# EAGLE design JOYSTICK (EAGLE 6.3)
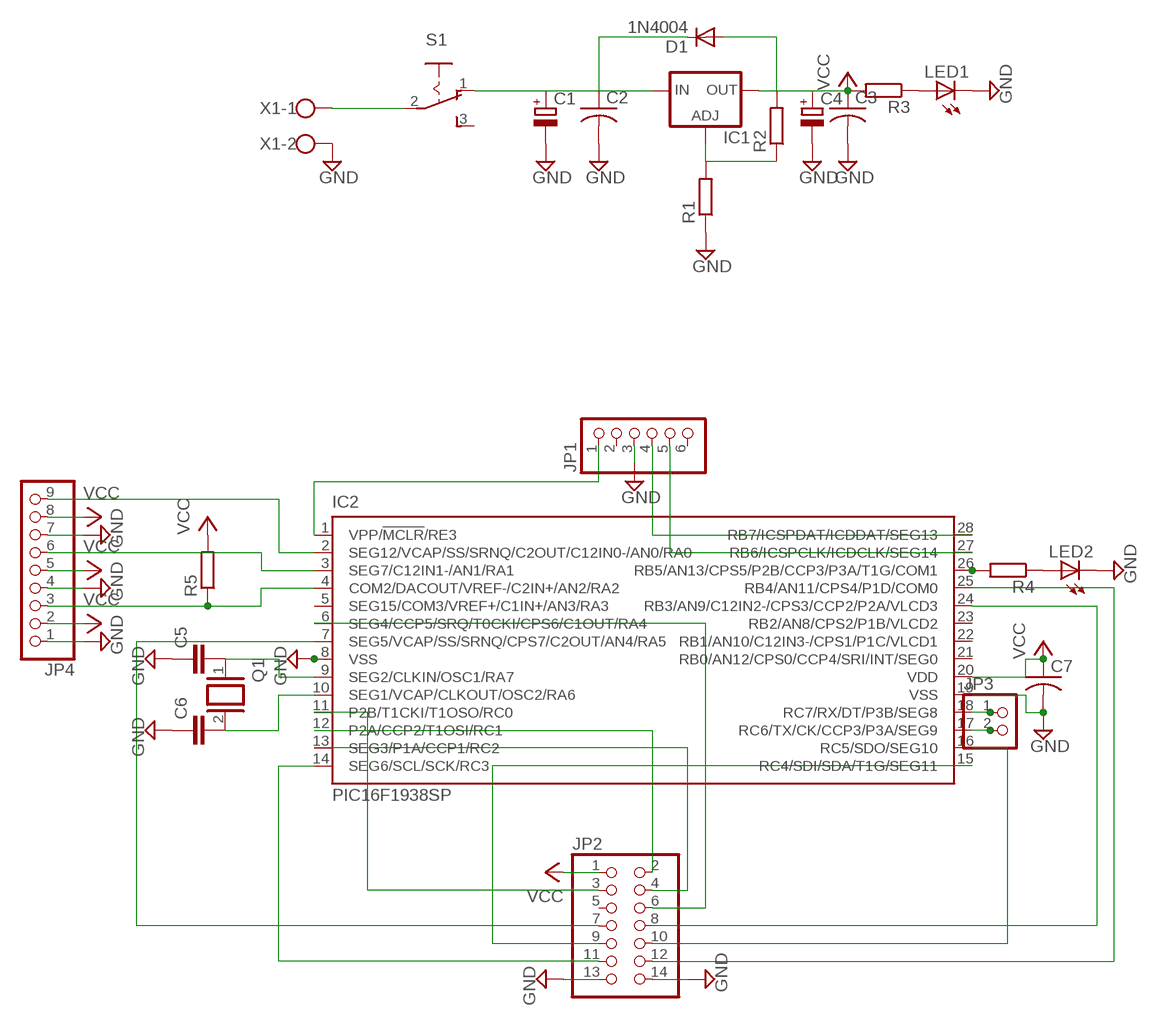
[diagram p0: schematic, sheet 1]

## Parts
C1  CPOL-EUE3.5-8  [E3,5-8]
C2  C-US050-030X075  [C050-030X075]
C3  C-US050-030X075  [C050-030X075]
C4  CPOL-EUE3.5-8  [E3,5-8]
C5  C-EU025-025X050  [C025-025X050]
C6  C-EU025-025X050  [C025-025X050]
C7  C-US050-030X075  [C050-030X075]
D1  1N4004  [DO41-10]
IC1  LM317TS  [317TS]
IC2  PIC16F1938SP  [DIL28-3]
JP1  PINHD-1X6  [1X06]
JP2  PINHD-2X7  [2X07]
JP3  PINHD-1X2  [1X02]
JP4  PINHD-1X9  [1X09]
LED1  LED5MM  [LED5MM]
LED2  LED5MM  [LED5MM]
Q1  XTAL/S  [QS]
R1  R-EU_0207/10  [0207/10]
R2  R-EU_0207/10  [0207/10]
R3  R-EU_0207/10  [0207/10]
R4  R-EU_0207/10  [0207/10]
R5  R-EU_0207/10  [0207/10]
S1  255SB  [255SB]
X1  W237-102  [W237-102]

## Nets
GND: C1.- C2.2 C3.2 C4.- C5.1 C6.1 C7.2 IC2.8(VSS) IC2.19(VSS) JP1.3 JP2.13 JP2.14 JP4.1 JP4.4 JP4.7 LED1.K(C) LED2.K(C) R1.1 X1.2
N$1: S1.2(P) X1.1
N$2: C1.+ C2.1 D1.C IC1.3(IN) S1.1(O)
N$3: IC2.11(P2B/T1CKI/T1OSO/RC0) JP2.3
N$4: LED1.A R3.1
N$5: IC1.1(ADJ) R1.2 R2.1
N$6: IC2.1(VPP/!MCLR!/RE3) JP1.1
N$7: IC2.2(SEG12/VCAP/SS/SRNQ/C2OUT/C12IN0-/AN0/RA0) JP4.9
N$8: IC2.3(SEG7/C12IN1-/AN1/RA1) JP4.6
N$9: IC2.4(COM2/DACOUT/VREF-/C2IN+/AN2/RA2) JP4.3 R5.1
N$10: IC2.12(P2A/CCP2/T1OSI/RC1) JP2.2
N$11: IC2.13(SEG3/P1A/CCP1/RC2) JP2.4
N$12: IC2.6(SEG4/CCP5/SRQ/T0CKI/CPS6/C1OUT/RA4) JP2.6
N$13: IC2.7(SEG5/VCAP/SS/SRNQ/CPS7/C2OUT/AN4/RA5) JP2.7
N$14: IC2.25(RB4/AN11/CPS4/P1D/COM0) JP2.12
N$15: IC2.24(RB3/AN9/C12IN2-/CPS3/CCP2/P2A/VLCD3) JP2.8
N$19: IC2.14(SEG6/SCL/SCK/RC3) JP2.11
N$20: IC2.15(RC4/SDI/SDA/T1G/SEG11) JP2.9
N$21: IC2.16(RC5/SDO/SEG10) JP2.10
N$22: IC2.17(RC6/TX/CK/CCP3/P3A/SEG9) JP3.2
N$23: IC2.18(RC7/RX/DT/P3B/SEG8) JP3.1
N$31: IC2.26(RB5/AN13/CPS5/P2B/CCP3/P3A/T1G/COM1) R4.2
N$32: IC2.27(RB6/ICSPCLK/ICDCLK/SEG14) JP1.5
N$33: IC2.28(RB7/ICSPDAT/ICDDAT/SEG13) JP1.4
N$36: C5.2 IC2.9(SEG2/CLKIN/OSC1/RA7) Q1.1
N$37: C6.2 IC2.10(SEG1/VCAP/CLKOUT/OSC2/RA6) Q1.2
N$40: LED2.A R4.1
VCC: C3.1 C4.+ C7.1 D1.A IC1.2(OUT) IC2.20(VDD) JP2.1 JP4.2 JP4.5 JP4.8 R2.2 R3.2 R5.2
Unconnected: IC2.5(SEG15/COM3/VREF+/C1IN+/AN3/RA3) IC2.21(RB0/AN12/CPS0/CCP4/SRI/INT/SEG0) IC2.22(RB1/AN10/C12IN3-/CPS1/P1C/VLCD1) IC2.23(RB2/AN8/CPS2/P1B/VLCD2) JP1.2 JP1.6 JP2.5 S1.3(S)

## Library data of the parts
C1 C4 = rcl:CPOL-EU: POLARIZED CAPACITOR, European symbol
C2 C3 C7 = rcl:C-US: CAPACITOR, American symbol
C5 C6 = rcl:C-EU: CAPACITOR, European symbol
D1 = diode:1N4004: DIODE general purpose rectifier, 1 A
IC1 = v-reg:LM317TS: VOLTAGE REGULATOR
IC2 = microchip:PIC16F19*: Flash-Based, 8-Bit CMOS Microcontrollers wtih LCD Driver and nanoWatt XLP Technology Auto generated by make-symbol-device-package-bsdl.ulp Rev. 33 Source: http://ww1.microchip.com/downloads/en/DeviceDoc/41364D.pdf; MPN: PIC16F1938-I/SP; OC_FARNELL: 1755829; OC_NEWARK: 08R1949
JP1 = pinhead:PINHD-1X6: PIN HEADER
JP2 = pinhead:PINHD-2X7: PIN HEADER
JP3 = pinhead:PINHD-1X2: PIN HEADER
JP4 = pinhead:PINHD-1X9: PIN HEADER
LED1 LED2 = led:LED: LED OSRAM: - CHIPLED LG R971, LG N971, LY N971, LG Q971, LY Q971, LO R971, LY R971 LH N974, LH R974 LS Q976, LO Q976, LY Q976 LO Q996 - Hyper CHIPLED LW Q18S LB Q993, LB Q99A, LB R99A - SideLED LS A670, LO A670, LY A670, LG A670, LP A670 LB A673, LV A673, LT A673, LW A673 LH A674 LY A675 LS A676, LA A676, LO A676, LY A676, LW A676 LS A679, LY A679, LG A679 - Hyper Micro SIDELED® LS Y876, LA Y876, LO Y876, LY Y876 LT Y87S - SmartLED LW L88C, LW L88S LB L89C, LB L89S, LG L890 LS L89K, LO L89K, LY L89K LS L896, LA L896, LO L896, LY L896 - TOPLED LS T670, LO T670, LY T670, LG T670, LP T670 LSG T670, LSP T670, LSY T670, LOP T670, LYG T670 LG T671, LOG T671, LSG T671 LB T673, LV T673, LT T673, LW T673 LH T674 LS T676, LA T676, LO T676, LY T676, LB T676, LH T676, LSB T676, LW T676 LB T67C, LV T67C, LT T67C, LS T67K, LO T67K, LY T67K, LW E67C LS E67B, LA E67B, LO E67B, LY E67B, LB E67C, LV E67C, LT E67C LW T67C LS T679, LY T679, LG T679 LS T770, LO T770, LY T770, LG T770, LP T770 LB T773, LV T773, LT T773, LW T773 LH T774 LS E675, LA E675, LY E675, LS T675 LS T776, LA T776, LO T776, LY T776, LB T776 LHGB T686 LT T68C, LB T68C - Hyper Mini TOPLED® LB M676 - Mini TOPLED Santana® LG M470 LS M47K, LO M47K, LY M47K Source: http://www.osram.convergy.de LUXEON: - LUMILED® LXK2-PW12-R00, LXK2-PW12-S00, LXK2-PW14-U00, LXK2-PW14-V00 LXK2-PM12-R00, LXK2-PM12-S00, LXK2-PM14-U00 LXK2-PE12-Q00, LXK2-PE12-R00, LXK2-PE12-S00, LXK2-PE14-T00, LXK2-PE14-U00 LXK2-PB12-K00, LXK2-PB12-L00, LXK2-PB12-M00, LXK2-PB14-N00, LXK2-PB14-P00, LXK2-PB14-Q00 LXK2-PR12-L00, LXK2-PR12-M00, LXK2-PR14-Q00, LXK2-PR14-R00 LXK2-PD12-Q00, LXK2-PD12-R00, LXK2-PD12-S00 LXK2-PH12-R00, LXK2-PH12-S00 LXK2-PL12-P00, LXK2-PL12-Q00, LXK2-PL12-R00 Source: www.luxeon.com KINGBRIGHT: KA-3528ASYC Source: www.kingbright.com
Q1 = special:XTAL/S: CRYSTAL
R1-R5 = resistor:R-EU_: RESISTOR, European symbol
S1 = switch:255SB: SLIDING SWITCH Distributor Buerklin, 11G810
X1 = con-wago-500:W237-102: WAGO SCREW CLAMP; MPN: 237-102; OC_FARNELL: unknown; OC_NEWARK: 70K9898

## Board
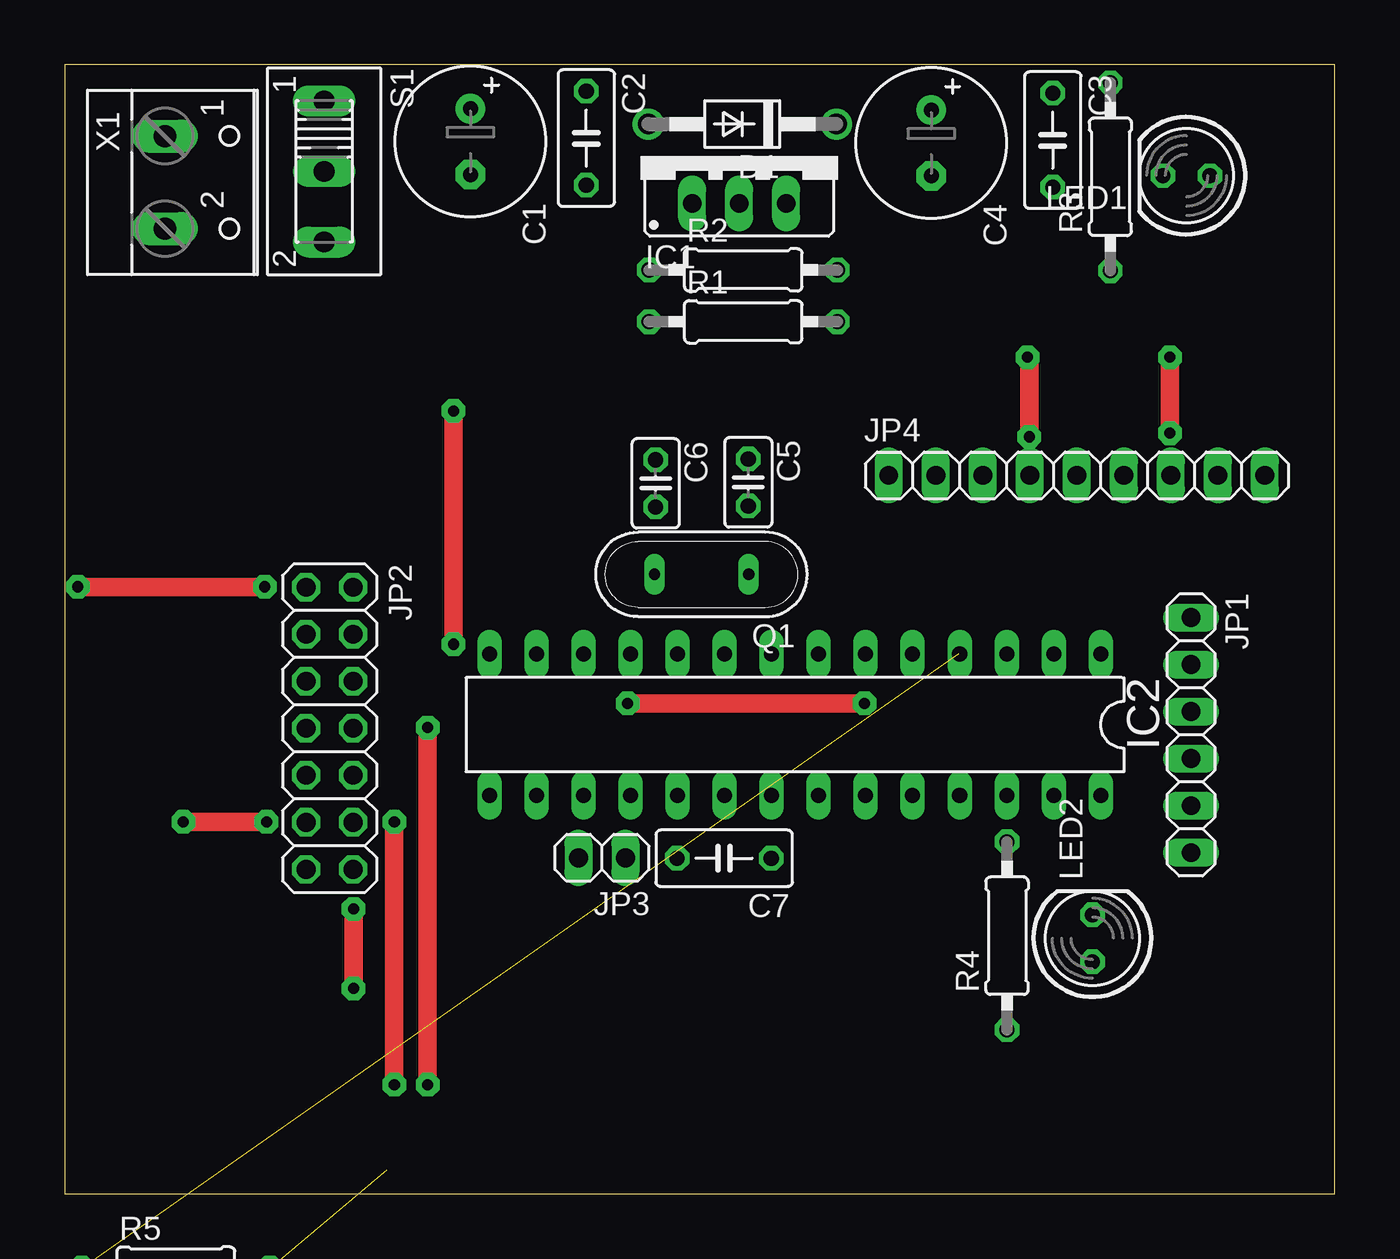
[diagram p1: board, top side]
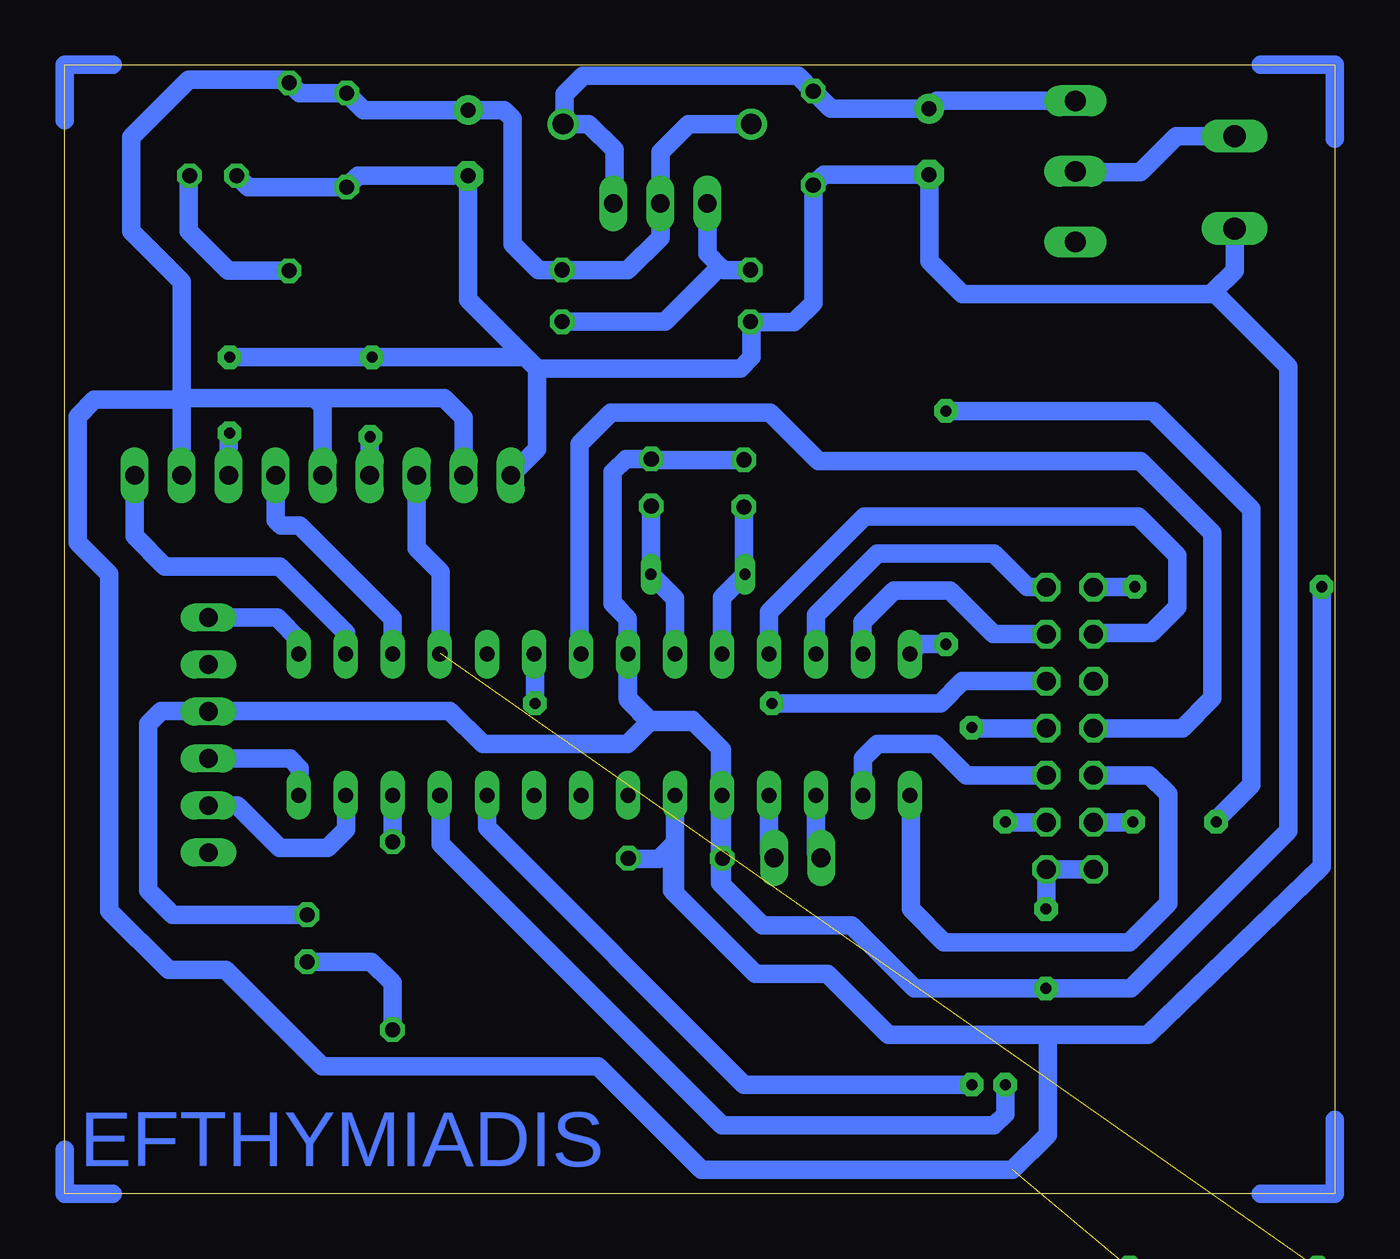
[diagram p2: board, bottom side, seen from below]

Size 68.6 x 61 mm. Coordinates in mm from the lower left corner, seen from the top.
Outline: 0,0 68.6,0 68.6,61 0,61 0,0
Copper layers (1*16): Top 0.035mm / dielectric 1.5mm / Bottom 0.035mm
Design rules "default": minimum track width 10mil, minimum drill 24mil, track to track 8mil, track to pad 8mil, pad to pad 8mil, via to via 8mil, smd to smd 8mil, copper to edge 40mil, drill to drill 8mil, minimum pad ring 10mil, minimum via ring 8mil, stop-mask expansion 4mil, vias tented up to drill 0mil, thermal gap 10mil

### Footprints (pad centres in the part's own frame; a part is rotated, then mirrored left to right if it is on the bottom)
E3,5-8 = drill 0.813 pad 1.6: + -1.778,0 | drill 0.813 pad 1.6 octagon: - 1.778,0
C050-030X075 = drill 0.813 octagon: 1 -2.54,0; 2 2.54,0
C025-025X050 = drill 0.813 octagon: 1 -1.27,0; 2 1.27,0
DO41-10 = drill 1.118: A 5.08,0; C -5.08,0
317TS = drill 1.016 long: 1 -2.54,-2.54; 2 0,-2.54; 3 2.54,-2.54
DIL28-3 = drill 0.813 long: 1 -16.51,-3.81; 2 -13.97,-3.81; 3 -11.43,-3.81; 4 -8.89,-3.81; 5 -6.35,-3.81; 6 -3.81,-3.81; 7 -1.27,-3.81; 8 1.27,-3.81; 9 3.81,-3.81; 10 6.35,-3.81; 11 8.89,-3.81; 12 11.43,-3.81; 13 13.97,-3.81; 14 16.51,-3.81; 15 16.51,3.81; 16 13.97,3.81; 17 11.43,3.81; 18 8.89,3.81; 19 6.35,3.81; 20 3.81,3.81; 21 1.27,3.81; 22 -1.27,3.81; 23 -3.81,3.81; 24 -6.35,3.81; 25 -8.89,3.81; 26 -11.43,3.81; 27 -13.97,3.81; 28 -16.51,3.81
1X06 = drill 1.016 long: 1 -6.35,0; 2 -3.81,0; 3 -1.27,0; 4 1.27,0; 5 3.81,0; 6 6.35,0
2X07 = drill 1.016 octagon: 1 -7.62,-1.27; 2 -7.62,1.27; 3 -5.08,-1.27; 4 -5.08,1.27; 5 -2.54,-1.27; 6 -2.54,1.27; 7 0,-1.27; 8 0,1.27; 9 2.54,-1.27; 10 2.54,1.27; 11 5.08,-1.27; 12 5.08,1.27; 13 7.62,-1.27; 14 7.62,1.27
1X02 = drill 1.016 long: 1 -1.27,0; 2 1.27,0
1X09 = drill 1.016 long: 1 -10.16,0; 2 -7.62,0; 3 -5.08,0; 4 -2.54,0; 5 0,0; 6 2.54,0; 7 5.08,0; 8 7.62,0; 9 10.16,0
LED5MM = drill 0.813 octagon: A -1.27,0; K 1.27,0
QS = drill 0.61 long: 1 -2.54,0; 2 2.54,0
0207/10 = drill 0.813 octagon: 1 -5.08,0; 2 5.08,0
255SB = drill 1.118 long: 1 -3.81,0; 2 0,0; 3 3.81,0
W237-102 = drill 1.194 long: 1 -2.5,-1.27; 2 2.5,-1.27

### Placement (x,y rotation side)
C1  21.91,56.85 270 top
C2  28.17,57.04 270 top
C3  53.37,56.93 270 top
C4  46.81,56.78 270 top
C5  36.92,38.44 270 top
C6  31.92,38.39 270 top
C7  35.62,18.13 180 top
D1  36.6,57.8 180 top
IC1  36.43,56.05 0 top
IC2  39.45,25.35 180 top
JP1  60.84,24.79 270 top
JP2  14.3,25.16 270 top
JP3  29.02,18.16 180 top
JP4  54.67,38.82 0 top
LED1  60.59,55.01 180 top
LED2  55.51,13.81 90 top
Q1  34.4,33.47 180 top
R1  36.65,47.12 0 top
R2  36.65,49.92 0 top
R3  56.48,54.95 90 top
R4  50.9,13.95 90 top
R5  6,-4 0 top  (outside the outline)
S1  14.01,55.24 270 top
X1  6.68,54.65 270 top

### Tracks (layer width: path | path; a pad name or v marks a point on that pad's centre or on a via)
GND  (via drill 0.6 pad 1.27)
  Top 1: v15.6,15.4 v15.6,11.1 | v59.7,41.1 v59.7,45.2 | v52.1,40.9 52.1,45.1 v52,45.2
  Bottom 1: X1.2 5.41,49.89 6.55,48.75 | 6.55,48.75 6.7,48.6 20.1,48.6 21.9,50.4 C1.- 27.6,55.07 C2.2 28.17,48.13 29.2,47.1 31.55,47.1 R1.1 31.5,47.05 31.5,45.2 32.1,44.6 43.1,44.6 | 43.75,45.25 46.81,48.31 C4.- 49,55 52.76,55 C3.2 58.7,54.39 LED1.K | 43.75,45.25 43.1,44.6 | 37,25.5 38.18,26.68 IC2.8 38.2,29.18 | 37,25.5 34.6,25.5 | 34.6,25.5 33.2,24.1 | 33.2,24.1 33.1,24 IC2.19 33.1,18.15 C7.2 33.1,18.11 33.1,16.7 | C6.1 36.87,39.66 C5.1 38.29,39.71 39,39 39,32 | 39,32 38.2,31.1 | 38.2,31.1 38.2,29.18 | JP2.13 JP2.14 15.57,15.43 v15.6,15.4 | LED2.K 62.78,15.08 64.1,16.4 64.1,25.4 63.4,26.1 60.88,26.1 | 60.88,26.1 JP1.3 | 33.1,16.7 30.9,14.5 26.1,14.5 22.7,11.1 v15.6,11.1 11,11.1 2.5,19.6 2.5,44.7 6.55,48.75 | 43.1,44.6 43.1,40.23 JP4.1 | 39,32 39,31.9 38.2,31.1 | 38.2,29.18 38.2,26.8 37,25.6 34.7,25.6 34.6,25.5 | 33.2,24.1 33.2,16.8 33.1,16.7 | 60.88,26.1 47.8,26.1 46,24.3 38.2,24.3 37,25.5 | JP4.7 59.75,41.05 v59.7,41.1 | v59.7,45.2 v52,45.2 51,45.2 43.8,45.2 43.75,45.25 | JP4.4 52.13,40.87 v52.1,40.9
N$1
  Bottom 1: X1.1 8.55,57.15 10.5,55.2 13.97,55.2 S1.2
N$2
  Bottom 1: S1.1 21.49,59.05 C1.+ 27.22,58.63 C2.1 29,60.4 40.6,60.4 41.6,59.4 41.6,57.88 D1.C 40.3,57.8 38.9,56.4 38.9,53.58 IC1.3
N$3
  Bottom 1: IC2.11 30.56,31.44 25.4,36.6 10.6,36.6 8.5,34.5 8.5,31.7 9.9,30.3 12.97,30.3 JP2.3
N$4
  Bottom 1: R3.1 59.77,49.87 61.9,52 61.9,54.97 LED1.A
N$5
  Bottom 1: IC1.1 33.89,50.79 33.2,50.1 | 33.2,50.1 33,49.9 31.59,49.9 R2.1 | R1.2 36.18,47.12 33.2,50.1
N$6
  Bottom 1: JP1.1 57.14,31.14 55.9,29.9 55.9,29.22 IC2.1
N$7
  Bottom 1: JP4.9 64.83,35.53 63.2,33.9 57,33.9 53.4,30.3 53.4,29.18 IC2.2
N$8
  Bottom 1: JP4.6 57.21,36.41 56.9,36.1 55.9,36.1 50.9,31.1 50.9,29.18 IC2.3
N$9  (1 unrouted)
  Bottom 1: JP4.3 49.59,34.89 48.3,33.6 48.3,29.2 IC2.4
N$10
  Bottom 1: IC2.12 28.02,31.28 24.7,34.6 18.4,34.6 16.6,32.8 15.59,32.8 JP2.2
N$11
  Bottom 1: JP2.4 18.44,30.24 20.8,32.6 23.8,32.6 25.5,30.9 25.5,29.18 IC2.13
N$12  (via drill 0.6 pad 1.27)
  Top 1: v30.4,26.5 v43.2,26.5
  Bottom 1: JP2.6 20.1,27.7 21.3,26.5 v30.4,26.5 | v43.2,26.5 43.2,29.1 IC2.6
N$13
  Bottom 1: JP2.7 8.24,25.16 6.6,26.8 6.6,35.7 10.5,39.6 27.9,39.6 30.5,42.2 39.1,42.2 40.8,40.5 40.8,29.24 IC2.7
N$14  (via drill 0.6 pad 1.27)
  Top 1: v17.8,20.1 v17.8,5.9
  Bottom 1: JP2.12 17.78,20.08 v17.8,20.1 | v17.8,5.9 17.8,4.3 18.4,3.7 33.1,3.7 48.3,18.9 48.3,21.5 IC2.25
N$15  (via drill 0.6 pad 1.27)
  Top 1: v19.6,25.2 v19.6,5.9
  Bottom 1: JP2.8 19.56,25.16 v19.6,25.2 | v19.6,5.9 31.9,5.9 45.8,19.8 IC2.24
N$16
  Bottom 1: 0,4 0,0 4,0
N$17
  Bottom 1: 0,57 0,61 4,61
N$18
  Bottom 1: 66,61 68.6,61 68.6,58
N$19  (via drill 0.6 pad 1.27)
  Top 1: v10.9,20.1 v6.4,20.1 | v21,42.3 v21,29.7
  Bottom 1: JP2.11 10.92,20.08 v10.9,20.1 | v6.4,20.1 6.4,20.2 4.5,22.1 4.5,37 9.8,42.3 v21,42.3 | v21,29.7 22.4,29.7 IC2.14
N$20
  Bottom 1: JP2.9 10.02,22.62 9,21.6 9,15.7 11.1,13.6 21.1,13.6 22.9,15.4 22.9,21.5 IC2.15
N$21
  Bottom 1: IC2.16 25.48,23.52 24.7,24.3 21.6,24.3 19.9,22.6 15.59,22.6 JP2.10
N$22
  Bottom 1: IC2.17 28.02,18.43 JP3.2
N$23
  Bottom 1: IC2.18 30.56,18.43 JP3.1
N$24
  Bottom 1: 66,0 68.6,0 68.6,2.4
N$31
  Bottom 1: R4.2 50.9,21.52 IC2.26
N$32
  Bottom 1: JP1.5 59.28,20.98 57,18.7 54.4,18.7 53.4,19.7 53.4,21.52 IC2.27
N$33
  Bottom 1: JP1.4 56.42,23.52 55.9,23 55.9,21.6 IC2.28
N$36
  Bottom 1: C5.2 36.92,33.49 Q1.1 35.64,32.17 IC2.9
N$37
  Bottom 1: C6.2 31.92,33.53 Q1.2 33.1,32.23 IC2.10
N$40
  Bottom 1: LED2.A 52.04,12.54 50.9,11.4 R4.1
VCC  (via drill 0.6 pad 1.27)  (1 unrouted)
  Top 1: v10.8,32.8 v0.7,32.8
  Bottom 1: D1.A 34.9,57.8 36.43,56.27 IC1.2 36.43,51.67 38.2,49.9 41.71,49.9 R2.2 41.75,49.9 43,49.9 44.4,51.3 44.4,58.1 44.86,58.56 C4.+ 52.46,58.56 C3.1 55.92,59.47 R3.2 56.65,60.2 61.9,60.2 65,57.1 65,52 62.29,49.29 62.29,43 | 35.8,18.8 35.64,18.96 IC2.20 35.64,16.24 | 35.8,18.8 36.5,18.1 38.13,18.1 C7.1 | JP2.1 10.82,32.78 v10.8,32.8 | v0.7,32.8 0.7,17.7 10.1,8.6 15.5,8.6 | 35.64,16.24 35.8,16.4 35.8,18.8 | JP4.8 62.29,43 | 35.64,16.24 31.3,11.9 27.4,11.9 24.1,8.6 15.5,8.6 | 15.5,8.6 15.5,3.2 17.4,1.3 34.2,1.3 39.8,6.9 54.7,6.9 59.9,12.1 63,12.1 66.2,15.3 66.2,33.5 67.9,35.2 67.9,42 67,42.9 62.39,42.9 62.29,43 | JP4.5 54.67,42.57 55.1,43 | 55.1,43 56,43 62.29,43 | JP4.2 47.05,41.95 48.1,43 55.1,43

### Text on the board
Bottom: EFTHYMIADIS